# Altium project LPCB280__RLOOP__GCU.PrjPCB
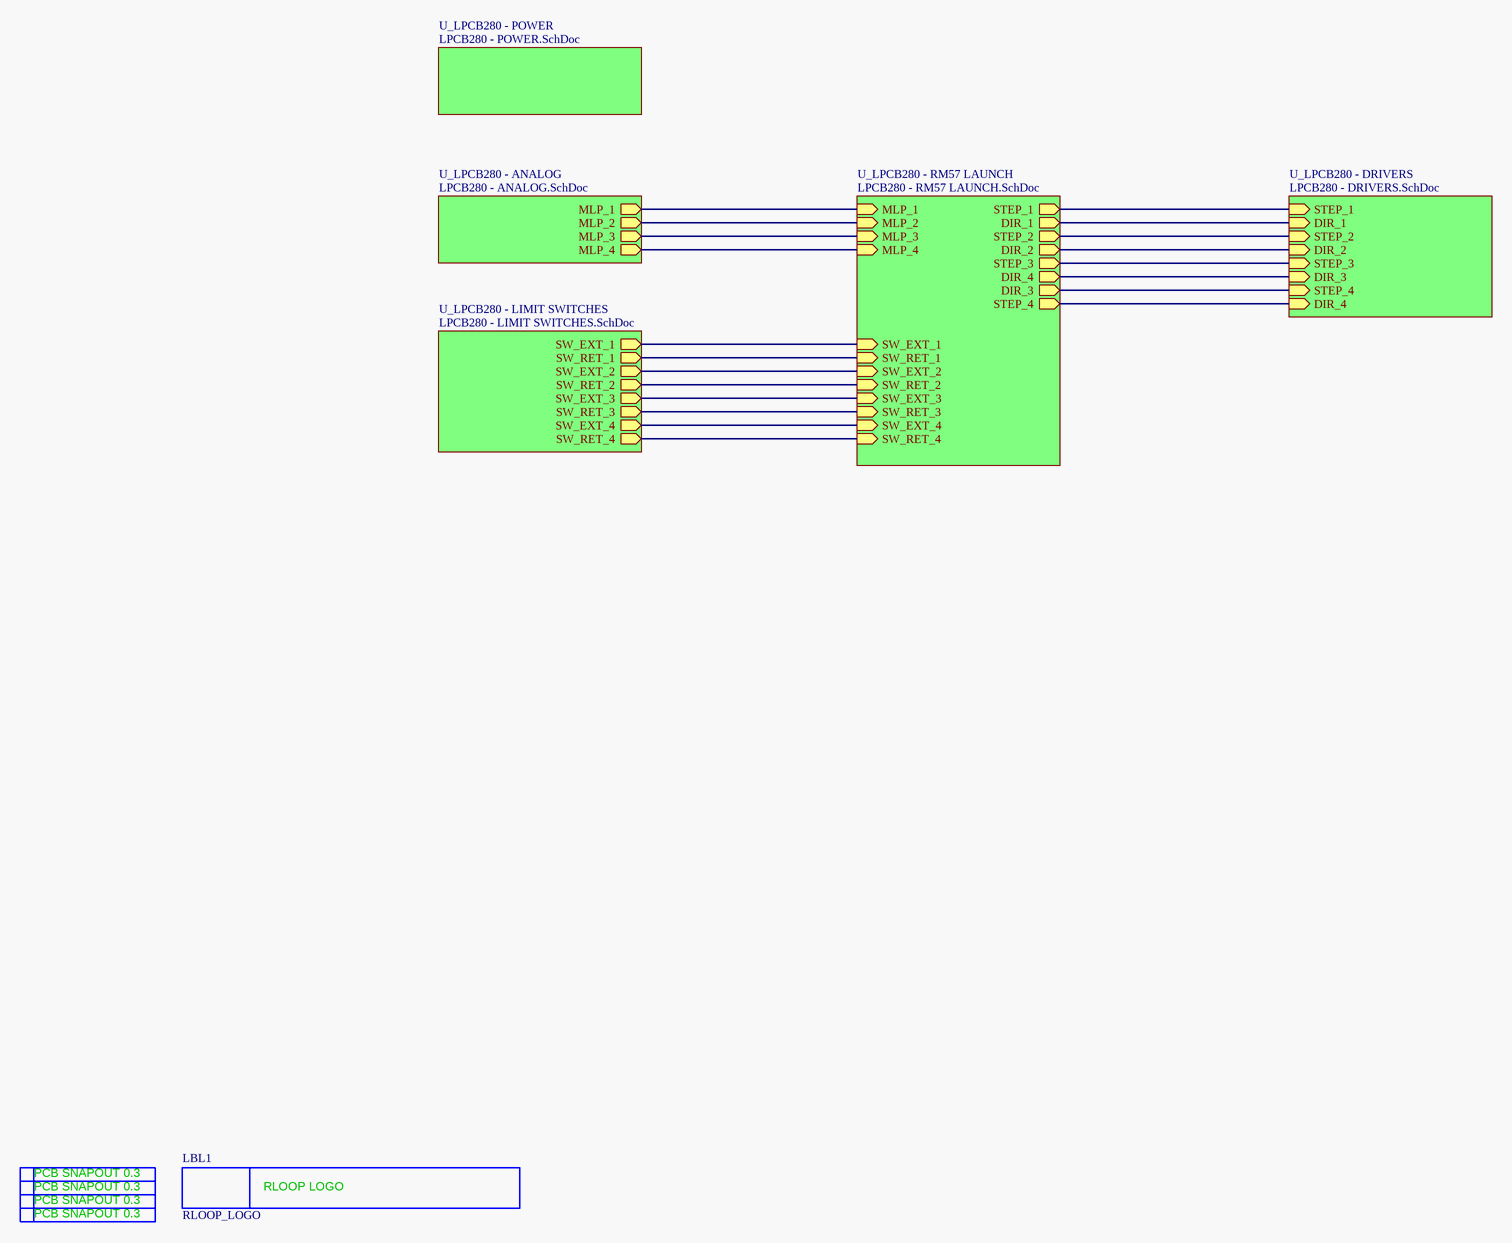
[diagram p0: LPCB280 - TOP.SchDoc]
6 sheets, 81 parts. Net scope: hierarchical (ports join the sheet entries above them; power ports are global).
Board files: LPCB280R0.PcbDoc, LPCB280R0__ASCII.PcbDoc
Sheets:
  LPCB280 - TOP.SchDoc
    U_LPCB280 - POWER = LPCB280 - POWER.SchDoc
    U_LPCB280 - RM57 LAUNCH = LPCB280 - RM57 LAUNCH.SchDoc
    U_LPCB280 - ANALOG = LPCB280 - ANALOG.SchDoc
    U_LPCB280 - LIMIT SWITCHES = LPCB280 - LIMIT SWITCHES.SchDoc
    U_LPCB280 - DRIVERS = LPCB280 - DRIVERS.SchDoc

## Sheet LPCB280 - TOP.SchDoc
size A3; Address1: Factory 10; Address2: 9-13 Dingley Avenue, Dandeong, VICTORIA 3175, AUSTRALIA; DocumentNumber: 1; Revision: 1; SheetNumber: 1; SheetTotal: 6; Lockie__PCB_SUB_ASSEMBLY: PCB Sub Component; Lockie__PCB_ASSEMBLY: PCB Assembly; Lockie__LDL: LPCB280; Lockie__PCB_DESCRIPTION: Gimbal Control Unit (GCU)

### Parts
LBL1  RLOOP_LOGO  [RLOOP_LOGO]  (no BOM)
SN1  PCB_SNAPOUT_0.3MM  [PCB_SNAPOUT_0.3MM]  (value not drawn)  (no BOM)
SN2  PCB_SNAPOUT_0.3MM  [PCB_SNAPOUT_0.3MM]  (value not drawn)  (no BOM)
SN3  PCB_SNAPOUT_0.3MM  [PCB_SNAPOUT_0.3MM]  (value not drawn)  (no BOM)
SN4  PCB_SNAPOUT_0.3MM  [PCB_SNAPOUT_0.3MM]  (value not drawn)  (no BOM)

### Sub-sheets
U_LPCB280 - ANALOG = LPCB280 - ANALOG.SchDoc: MLP_1 (out), MLP_2 (out), MLP_3 (out), MLP_4 (out)
U_LPCB280 - DRIVERS = LPCB280 - DRIVERS.SchDoc: STEP_1 (in), DIR_1 (in), STEP_2 (in), DIR_2 (in), STEP_3 (in), DIR_3 (in), STEP_4 (in), DIR_4 (in)
U_LPCB280 - LIMIT SWITCHES = LPCB280 - LIMIT SWITCHES.SchDoc: SW_EXT_1 (out), SW_RET_1 (out), SW_EXT_2 (out), SW_RET_2 (out), SW_EXT_3 (out), SW_RET_3 (out), SW_EXT_4 (out), SW_RET_4 (out)
U_LPCB280 - POWER = LPCB280 - POWER.SchDoc: no entries
U_LPCB280 - RM57 LAUNCH = LPCB280 - RM57 LAUNCH.SchDoc: MLP_1 (in), MLP_2 (in), MLP_3 (in), MLP_4 (in), SW_EXT_1 (in), SW_RET_1 (in), SW_EXT_4 (in), SW_RET_4 (in), SW_EXT_3 (in), SW_RET_3 (in), SW_EXT_2 (in), SW_RET_2 (in), STEP_1 (out), DIR_1 (out), STEP_2 (out), DIR_2 (out), STEP_3 (out), DIR_4 (out), DIR_3 (out), STEP_4 (out)

### Nets
DIR_1: sheet U_LPCB280 - RM57 LAUNCH/DIR_1, sheet U_LPCB280 - DRIVERS/DIR_1
DIR_2: sheet U_LPCB280 - RM57 LAUNCH/DIR_2, sheet U_LPCB280 - DRIVERS/DIR_2
DIR_3: sheet U_LPCB280 - RM57 LAUNCH/DIR_3, sheet U_LPCB280 - DRIVERS/STEP_4
DIR_4: sheet U_LPCB280 - RM57 LAUNCH/DIR_4, sheet U_LPCB280 - DRIVERS/DIR_3
STEP_1: sheet U_LPCB280 - RM57 LAUNCH/STEP_1, sheet U_LPCB280 - DRIVERS/STEP_1
STEP_2: sheet U_LPCB280 - RM57 LAUNCH/STEP_2, sheet U_LPCB280 - DRIVERS/STEP_2
STEP_3: sheet U_LPCB280 - RM57 LAUNCH/STEP_3, sheet U_LPCB280 - DRIVERS/STEP_3
STEP_4: sheet U_LPCB280 - RM57 LAUNCH/STEP_4, sheet U_LPCB280 - DRIVERS/DIR_4
SW_EXT_1: sheet U_LPCB280 - RM57 LAUNCH/SW_EXT_1, sheet U_LPCB280 - LIMIT SWITCHES/SW_EXT_1
SW_EXT_2: sheet U_LPCB280 - RM57 LAUNCH/SW_EXT_2, sheet U_LPCB280 - LIMIT SWITCHES/SW_EXT_2
SW_EXT_3: sheet U_LPCB280 - RM57 LAUNCH/SW_EXT_3, sheet U_LPCB280 - LIMIT SWITCHES/SW_EXT_3
SW_EXT_4: sheet U_LPCB280 - RM57 LAUNCH/SW_EXT_4, sheet U_LPCB280 - LIMIT SWITCHES/SW_EXT_4
SW_RET_1: sheet U_LPCB280 - RM57 LAUNCH/SW_RET_1, sheet U_LPCB280 - LIMIT SWITCHES/SW_RET_1
SW_RET_2: sheet U_LPCB280 - RM57 LAUNCH/SW_RET_2, sheet U_LPCB280 - LIMIT SWITCHES/SW_RET_2
SW_RET_3: sheet U_LPCB280 - RM57 LAUNCH/SW_RET_3, sheet U_LPCB280 - LIMIT SWITCHES/SW_RET_3
SW_RET_4: sheet U_LPCB280 - RM57 LAUNCH/SW_RET_4, sheet U_LPCB280 - LIMIT SWITCHES/SW_RET_4
NetCN1_2: sheet U_LPCB280 - RM57 LAUNCH/MLP_1, sheet U_LPCB280 - ANALOG/MLP_1
NetCN2_2: sheet U_LPCB280 - RM57 LAUNCH/MLP_3, sheet U_LPCB280 - ANALOG/MLP_3
NetCN4_2: sheet U_LPCB280 - RM57 LAUNCH/MLP_2, sheet U_LPCB280 - ANALOG/MLP_2
NetCN5_2: sheet U_LPCB280 - RM57 LAUNCH/MLP_4, sheet U_LPCB280 - ANALOG/MLP_4

### Notes on the sheet
- PCB COMPONENT DESCRIPTION
- LDL NUMBER
- Assembly Details
- Size
- Drawing File Name
- Revision
- http://sil3.com.au
  ACN: 123 529 064
  Factory 10
  9-13 Dingley Avenue
  Dandenong, VICTORIA
  Australia
- Scale
- A3
- Sheet Details
- N.T.S
- Sheet:
- Of:
- (in symbol PCB_SNAPOUT_0.3MM) PCB SNAPOUT 0.3
- (in symbol RLOOP_LOGO) RLOOP LOGO

### Library data of the parts
LBL1 = RLOOP_LOGO: FMEDA__CHANNEL: DIAG; FMEDA__FUNCTION_IN_SYSTEM: *
SN1-SN4 = PCB_SNAPOUT_0.3MM: PCB Snapout + 0.3mm; FMEDA__CHANNEL: DIAG; FMEDA__FUNCTION_IN_SYSTEM: *

## Sheet LPCB280 - POWER.SchDoc
size A3; Address1: Factory 10; Address2: 9-13 Dingley Avenue, Dandeong, VICTORIA 3175, AUSTRALIA; DocumentNumber: 5; Revision: 1; SheetNumber: 5; SheetTotal: 6; Lockie__PCB_SUB_ASSEMBLY: PCB Sub Component; Lockie__PCB_ASSEMBLY: PCB Assembly; Lockie__LDL: LPCB280; Lockie__PCB_DESCRIPTION: Gimbal Control Unit (GCU)
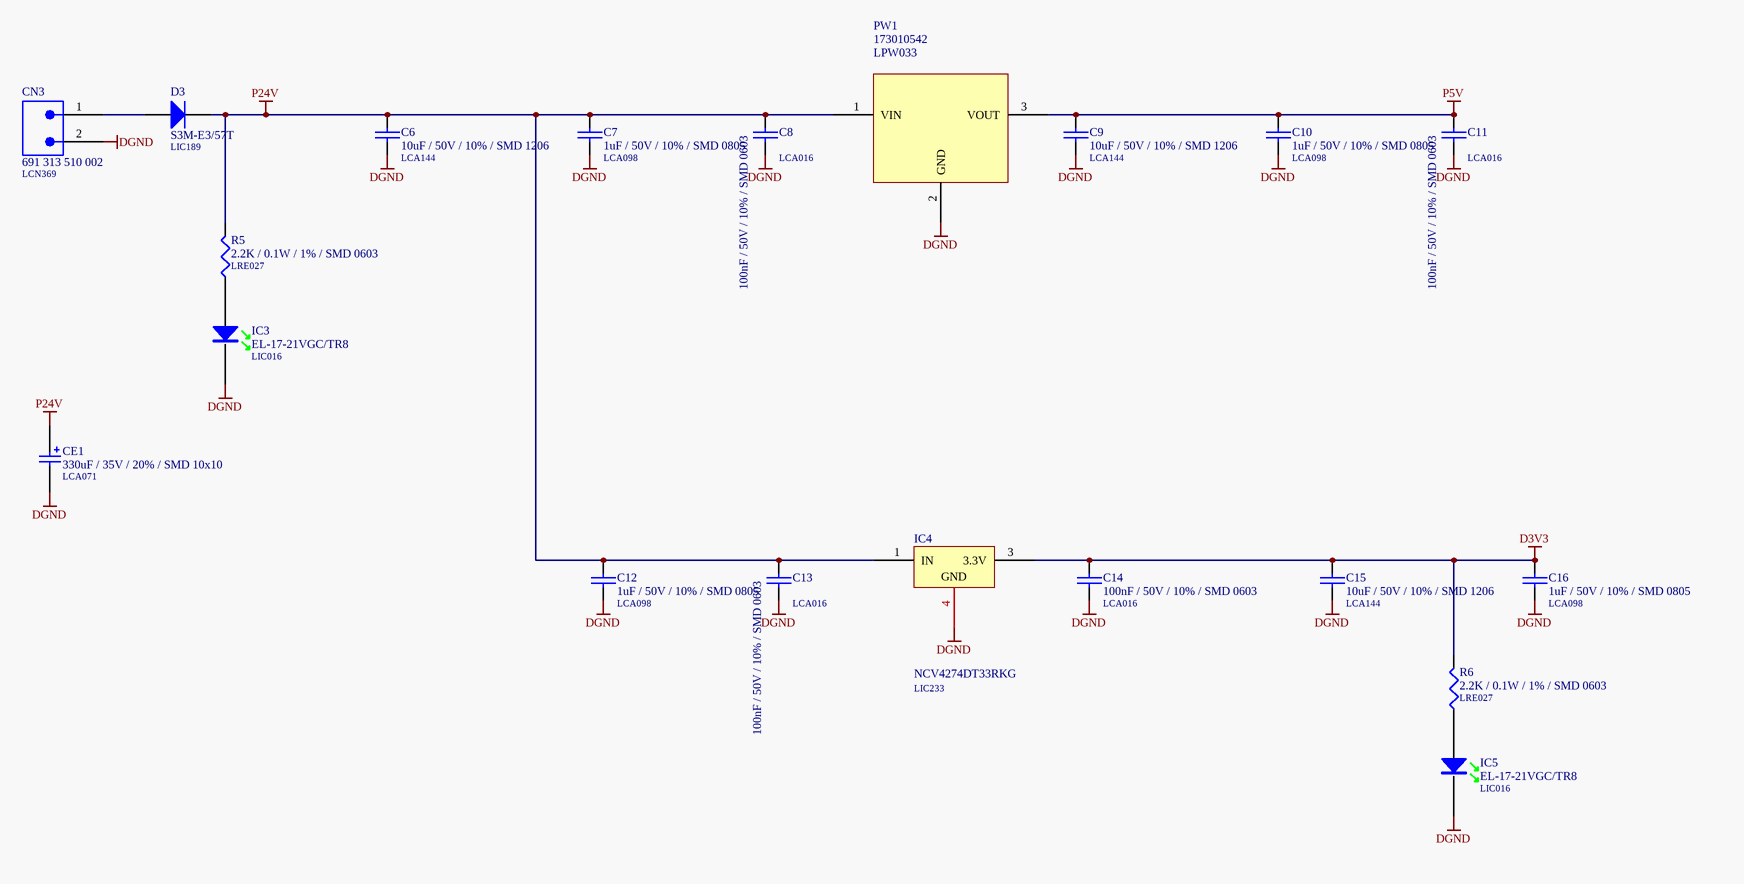
[diagram p1: LPCB280 - POWER.SchDoc]

### Parts
C6  10uF / 50V / 10% / SMD 1206  LDL_NUMBER: LCA144  [LFP043__CC3216-1206]
C7  1uF / 50V / 10% / SMD 0805  LDL_NUMBER: LCA098  [LFP010__CC2012-0805-IPC7351_B]
C8  100nF / 50V / 10% / SMD 0603  LDL_NUMBER: LCA016  [LFP011__CC1608-0603-IPC7351_B]
C9  10uF / 50V / 10% / SMD 1206  LDL_NUMBER: LCA144  [LFP043__CC3216-1206]
C10  1uF / 50V / 10% / SMD 0805  LDL_NUMBER: LCA098  [LFP010__CC2012-0805-IPC7351_B]
C11  100nF / 50V / 10% / SMD 0603  LDL_NUMBER: LCA016  [LFP011__CC1608-0603-IPC7351_B]
C12  1uF / 50V / 10% / SMD 0805  LDL_NUMBER: LCA098  [LFP010__CC2012-0805-IPC7351_B]
C13  100nF / 50V / 10% / SMD 0603  LDL_NUMBER: LCA016  [LFP011__CC1608-0603-IPC7351_B]
C14  100nF / 50V / 10% / SMD 0603  LDL_NUMBER: LCA016  [LFP011__CC1608-0603-IPC7351_B]
C15  10uF / 50V / 10% / SMD 1206  LDL_NUMBER: LCA144  [LFP043__CC3216-1206]
C16  1uF / 50V / 10% / SMD 0805  LDL_NUMBER: LCA098  [LFP010__CC2012-0805-IPC7351_B]
CE1  330uF / 35V / 20% / SMD 10x10  LDL_NUMBER: LCA071  [LFP041__NICHICON_WT_10X10]
CN3  691 313 510 002  LDL_NUMBER: LCN369  [691 313 510 002]
D3  S3M-E3/57T  LDL_NUMBER: LIC189  [LFP040__DO-214AB]
IC3  EL-17-21VGC/TR8  LDL_NUMBER: LIC016  [CR2012-0805-LED]
IC4  NCV4274DT33RKG  LDL_NUMBER: LIC233  [LFP019__369A-13]
IC5  EL-17-21VGC/TR8  LDL_NUMBER: LIC016  [CR2012-0805-LED]
PW1  173010542  LDL_NUMBER: LPW033  [173010542]
R5  2.2K / 0.1W / 1% / SMD 0603  LDL_NUMBER: LRE027  [LFP020__CR1608-0603-IPC7351_B]
R6  2.2K / 0.1W / 1% / SMD 0603  LDL_NUMBER: LRE027  [LFP020__CR1608-0603-IPC7351_B]

### Nets
D3V3: C14.1 C15.1 C16.1 IC4.3(3.3V) R6.2
DGND: C6.2 C7.2 C8.2 C9.2 C10.2 C11.2 C12.2 C13.2 C14.2 C15.2 C16.2 CE1.2 CN3.2 IC3.K IC4.4(GND) IC5.K PW1.2(GND)
P5V: C9.1 C10.1 C11.1 PW1.3(VOUT)
P24V: C6.1 C7.1 C8.1 C12.1 C13.1 CE1.1 D3.1(K) IC4.1(IN) PW1.1(VIN) R5.2
NetCN3_1: CN3.1 D3.2(A)
NetIC3_A: IC3.A R5.1
NetIC5_A: IC5.A R6.1

### Notes on the sheet
- PCB COMPONENT DESCRIPTION
- LDL NUMBER
- Assembly Details
- Size
- Drawing File Name
- Revision
- http://sil3.com.au
  ACN: 123 529 064
  Factory 10
  9-13 Dingley Avenue
  Dandenong, VICTORIA
  Australia
- Scale
- A3
- Sheet Details
- N.T.S
- Sheet:
- Of:

### Library data of the parts
C6 C9 C15 = 10uF / 50V / 10% / SMD 1206: Capacitor, Ceramic Chip, 10uF, 50V, X5R, 10%, SMD 1206 [LCA144]; Value: 10u; FMEDA__OPERATING__TEMP_MAX: 85; FMEDA__OPERATING__TEMP_MIN: -55; FMEDA__OPERATING__TEMP_TYP: 27; FMEDA__OPERATING__VOLTAGE_MAX: 50; FMEDA__OPERATING__VOLTAGE_MIN: 0; FMEDA__CHANNEL: COM; FMEDA__FUNCTION_IN_SYSTEM: *
C7 C10 C12 C16 = 1uF / 50V / 10% / SMD 0805: Capacitor, Ceramic Chip, 1uF, 50V, SMD 0805 [LCA098]; Value: 1u; FMEDA__OPERATING__VOLTAGE_MAX: 3.3; FMEDA__OPERATING__VOLTAGE_MIN: 0; FMEDA__OPERATING__TEMP_MAX: 50; FMEDA__OPERATING__TEMP_MIN: -20; FMEDA__OPERATING__TEMP_TYP: 27; FMEDA__CHANNEL: COM; FMEDA__OPERATING__VOLTAGE_TYP: 3.3; FMEDA__FUNCTION_IN_SYSTEM: *
C8 C11 C13 C14 = 100nF / 50V / 10% / SMD 0603: Capacitor, Ceramic Chip, 100nF (0.1uF), 50V, 5%, SMD 0603 [LCA016]; Value: 100n; FMEDA__OPERATING__VOLTAGE_MIN: 0; FMEDA__OPERATING__VOLTAGE_MAX: 3.3; FMEDA__OPERATING__TEMP_MIN: -20; FMEDA__OPERATING__TEMP_TYP: 27; FMEDA__OPERATING__TEMP_MAX: 50; FMEDA__CHANNEL: COM; FMEDA__FUNCTION_IN_SYSTEM: *; FMEDA__OPERATING__VOLTAGE_TYP: 3.3
CE1 = 330uF / 35V / 20% / SMD 10x10: Capacitor, Aluminum Electrolytic, 330uF, 35V, 20%, SMD (10mm x 10mm) [LCA071]; FMEDA__OPERATING__TEMP_MAX: 50; FMEDA__OPERATING__TEMP_MIN: -20; FMEDA__OPERATING__TEMP_TYP: 27; FMEDA__OPERATING__VOLTAGE_MAX: 0; Value: 330u; FMEDA__CHANNEL: COM; FMEDA__OPERATING__VOLTAGE_MIN: 0; FMEDA__OPERATING__VOLTAGE_TYP: 0; FMEDA__FUNCTION_IN_SYSTEM: *
CN3 = 691 313 510 002: Connector, Pluggable Terminal Block, 5.08mm, 2 Way, PTH; FMEDA__CHANNEL: COM; FMEDA__OPERATING__CURRENT_MAX: 0; FMEDA__OPERATING__TEMP_MAX: 50; FMEDA__OPERATING__TEMP_MIN: -20; FMEDA__OPERATING__TEMP_TYP: 27; FMEDA__OPERATING__VOLTAGE_MAX: 16; FMEDA__OPERATING__VOLTAGE_TYP: 12; FMEDA__FUNCTION_IN_SYSTEM: *; FMEDA__OPERATING__CURRENT_MIN: 0; FMEDA__OPERATING__CURRENT_TYP: 0; FMEDA__OPERATING__VOLTAGE_MIN: 0
D3 = S3M-E3/57T: Diode, General Purpose Rectifier, 3A, 200V, SMD DO-214AB [LIC189]; FMEDA__OPERATING__CURRENT_MAX: 0; FMEDA__OPERATING__TEMP_MAX: 50; FMEDA__OPERATING__TEMP_MIN: -20; FMEDA__OPERATING__TEMP_TYP: 27; FMEDA__CHANNEL: COM; FMEDA__OPERATING__CURRENT_MIN: 0; FMEDA__OPERATING__CURRENT_TYP: 0; FMEDA__OPERATING__VOLTAGE_MAX: 0; FMEDA__OPERATING__VOLTAGE_MIN: 0; FMEDA__OPERATING__VOLTAGE_TYP: 0; FMEDA__FUNCTION_IN_SYSTEM: *
IC3 IC5 = EL-17-21VGC/TR8: LED, SMD, 0805 Green [LIC016]; FMEDA__OPERATING__TEMP_MAX: 50; FMEDA__OPERATING__TEMP_MIN: -20; FMEDA__OPERATING__TEMP_TYP: 27; FMEDA__CHANNEL: COM; FMEDA__FUNCTION_IN_SYSTEM: *
IC4 = NCV4274DT33RKG: IC, Voltage Regulator, 400mA, 3.3V LDO, SMD DPAK [LIC233]; FMEDA__OPERATING__OUTPUT_CURRENT_MIN: 0; FMEDA__OPERATING__TEMP_MAX: 50; FMEDA__OPERATING__TEMP_MIN: -20; FMEDA__OPERATING__TEMP_TYP: 27; VALUE: 0; Note: Obey Thermal Design Rules; FMEDA__CHANNEL: COM; FMEDA__OPERATING__OUTPUT_CURRENT_TYP: 0; FMEDA__OPERATING__VOLTAGE_MAX: 0; FMEDA__OPERATING__VOLTAGE_MIN: 0; FMEDA__OPERATING__VOLTAGE_TYP: 0; FMEDA__FUNCTION_IN_SYSTEM: *
R5 R6 = 2.2K / 0.1W / 1% / SMD 0603: Resistor, Ceramic Chip, 2.2K, 0.1W, 1%, SMD 0603 [LRE027]; FMEDA__OPERATING__VOLTAGE_MIN: 0; FMEDA__OPERATING__TEMP_MIN: -20; FMEDA__OPERATING__TEMP_TYP: 27; FMEDA__OPERATING__TEMP_MAX: 50; FMEDA__CHANNEL: COM; VALUE: 2.2K; FMEDA__OPERATING__VOLTAGE_MAX: 0; FMEDA__OPERATING__POWER_MIN: 0; FMEDA__OPERATING__POWER_MAX: 0; FMEDA__FUNCTION_IN_SYSTEM: *; FMEDA__OPERATING__VOLTAGE_TYP: 0

## Sheet LPCB280 - RM57 LAUNCH.SchDoc
size A3; Address1: Factory 10; Address2: 9-13 Dingley Avenue, Dandeong, VICTORIA 3175, AUSTRALIA; DocumentNumber: 6; Revision: 1; SheetNumber: 6; SheetTotal: 6; Lockie__PCB_SUB_ASSEMBLY: PCB Sub Component; Lockie__PCB_ASSEMBLY: PCB Assembly; Lockie__LDL: LPCB280; Lockie__PCB_DESCRIPTION: Gimbal Control Unit (GCU)
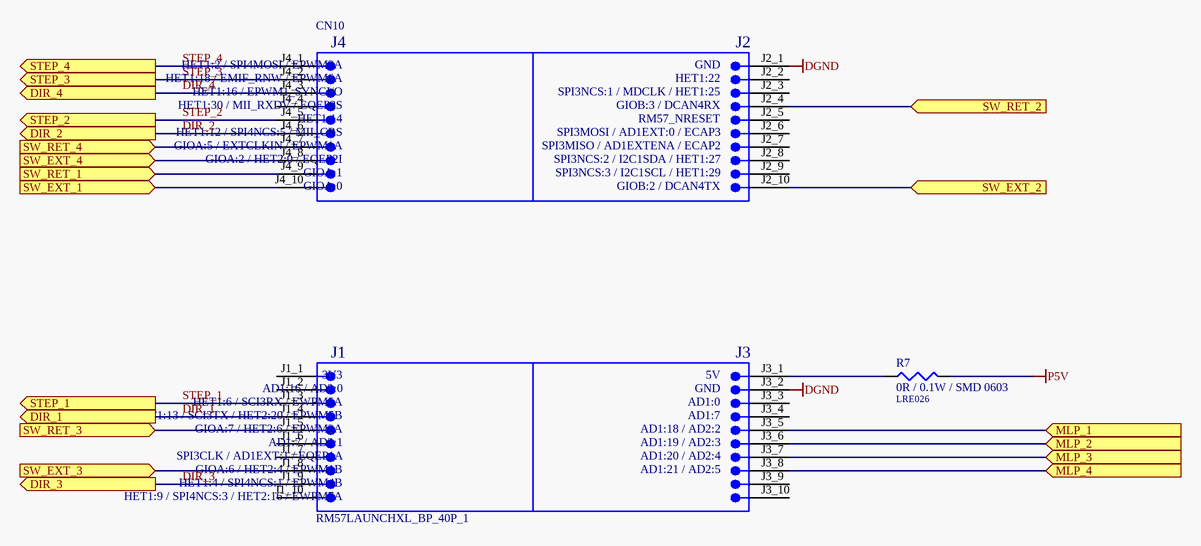
[diagram p2: LPCB280 - RM57 LAUNCH.SchDoc]

### Parts
CN10  RM57LAUNCHXL_BP_40P_1  [RM57LAUNCHXL_BP_40P_1]  (no BOM)
R7  0R / 0.1W / SMD 0603  LDL_NUMBER: LRE026  [LFP020__CR1608-0603-IPC7351_B]

### Ports
DIR_1 (out), DIR_2 (out), DIR_3 (out), DIR_4 (out), MLP_1 (in), MLP_2 (in), MLP_3 (in), MLP_4 (in), STEP_1 (out), STEP_2 (out), STEP_3 (out), STEP_4 (out), SW_EXT_1 (in), SW_EXT_2 (in), SW_EXT_3 (in), SW_EXT_4 (in), SW_RET_1 (in), SW_RET_2 (in), SW_RET_3 (in), SW_RET_4 (in)

### Nets
DGND: CN10.J2_1 CN10.J3_2
P5V: R7.2
DIR_1: CN10.J1_4 ; port DIR_1
DIR_2: CN10.J4_6 ; port DIR_2
DIR_3: CN10.J1_9 ; port DIR_3
DIR_4: CN10.J4_3 ; port DIR_4
STEP_1: CN10.J1_3 ; port STEP_1
STEP_2: CN10.J4_5 ; port STEP_2
STEP_3: CN10.J4_2 ; port STEP_3
STEP_4: CN10.J4_1 ; port STEP_4
SW_EXT_1: CN10.J4_10 ; port SW_EXT_1
SW_EXT_2: CN10.J2_10 ; port SW_EXT_2
SW_EXT_3: CN10.J1_8 ; port SW_EXT_3
SW_EXT_4: CN10.J4_8 ; port SW_EXT_4
SW_RET_1: CN10.J4_9 ; port SW_RET_1
SW_RET_2: CN10.J2_4 ; port SW_RET_2
SW_RET_3: CN10.J1_5 ; port SW_RET_3
SW_RET_4: CN10.J4_7 ; port SW_RET_4
NetCN1_2: CN10.J3_5 ; port MLP_1
NetCN2_2: CN10.J3_7 ; port MLP_3
NetCN4_2: CN10.J3_6 ; port MLP_2
NetCN5_2: CN10.J3_8 ; port MLP_4
NetCN10_J3_1: CN10.J3_1 R7.1

Not connected (* = marked no-connect by the designer): CN10 J1_1 J1_2 J1_6 J1_7 J1_10 J2_2 J2_3 J2_5 J2_6 J2_7 J2_8 J2_9 J3_3 J3_4 J3_9 J3_10 J4_4

### Notes on the sheet
- PCB COMPONENT DESCRIPTION
- LDL NUMBER
- Assembly Details
- Size
- Drawing File Name
- Revision
- http://sil3.com.au
  ACN: 123 529 064
  Factory 10
  9-13 Dingley Avenue
  Dandenong, VICTORIA
  Australia
- Scale
- A3
- Sheet Details
- N.T.S
- Sheet:
- Of:
- (in symbol RM57LAUNCHXL_BP_40P_1) J4; J2; HET1:2 / SPI4MOSI / EPWM3A; GND; HET1:18 / EMIF_RNW / EPWM6A; HET1:22; HET1:16 / EPWM1_SYNCI/O; SPI3NCS:1 / MDCLK / HET1:25; HET1:30 / MII_RXDV / EQEP2S; GIOB:3 / DCAN4RX; HET1:14; RM57_NRESET; HET1:12 / SPI4NCS:5 / MII_CRS; SPI3MOSI / AD1EXT:0 / ECAP3; GIOA:5 / EXTCLKIN / EPWM1A; SPI3MISO / AD1EXTENA / ECAP2; GIOA:2 / HET2:0 / EQEP2I; SPI3NCS:2 / I2C1SDA / HET1:27; GIOA:1; SPI3NCS:3 / I2C1SCL / HET1:29; GIOA:0; GIOB:2 / DCAN4TX; J1; J3; 3V3; 5V; AD1:16 / AD2:0; HET1:6 / SCI3RX / EWPM5A; AD1:0; HET1:13 / SCI3TX / HET2:20 / EPWM5B; AD1:7; GIOA:7 / HET2:6 / EPWM2A; AD1:18 / AD2:2; AD1:7 / AD2:1; AD1:19 / AD2:3; SPI3CLK / AD1EXT:1 / EQEP1A; AD1:20 / AD2:4; GIOA:6 / HET2:4 / EPWM1B; AD1:21 / AD2:5; HET1:4 / SPI4NCS:1 / EPWM4B; HET1:9 / SPI4NCS:3 / HET2:16 / EWPM7A

### Library data of the parts
CN10 = RM57LAUNCHXL_BP_40P_1: Connector, RM57L843 LaunchXL, 40Pin Boosterpack Site1; FMEDA__CHANNEL: COM; FMEDA__OPERATING__CURRENT_MAX: 0; FMEDA__OPERATING__TEMP_MAX: 50; FMEDA__OPERATING__TEMP_MIN: -20; FMEDA__OPERATING__TEMP_TYP: 27; FMEDA__OPERATING__VOLTAGE_MAX: 16; FMEDA__OPERATING__VOLTAGE_TYP: 12; FMEDA__FUNCTION_IN_SYSTEM: *; FMEDA__OPERATING__CURRENT_MIN: 0; FMEDA__OPERATING__CURRENT_TYP: 0; FMEDA__OPERATING__VOLTAGE_MIN: 0
R7 = 0R / 0.1W / SMD 0603: Resistor, Ceramic Chip, 0R, 0.1W, SMD 0603 [LRE026]; Value: 0; FMEDA__OPERATING__TEMP_MAX: 50; FMEDA__OPERATING__TEMP_MIN: -20; FMEDA__OPERATING__TEMP_TYP: 27; FMEDA__CHANNEL: COM; FMEDA__OPERATING__POWER_MAX: 0; FMEDA__OPERATING__POWER_MIN: 0; FMEDA__OPERATING__VOLTAGE_MAX: 0; FMEDA__OPERATING__VOLTAGE_MIN: 0; FMEDA__OPERATING__VOLTAGE_TYP: 0; FMEDA__FUNCTION_IN_SYSTEM: *

## Sheet LPCB280 - ANALOG.SchDoc
size A3; Address1: Factory 10; Address2: 9-13 Dingley Avenue, Dandeong, VICTORIA 3175, AUSTRALIA; DocumentNumber: 2; Revision: 1; SheetNumber: 2; SheetTotal: 6; Lockie__PCB_SUB_ASSEMBLY: PCB Sub Component; Lockie__PCB_ASSEMBLY: PCB Assembly; Lockie__LDL: LPCB280; Lockie__PCB_DESCRIPTION: Gimbal Control Unit (GCU)
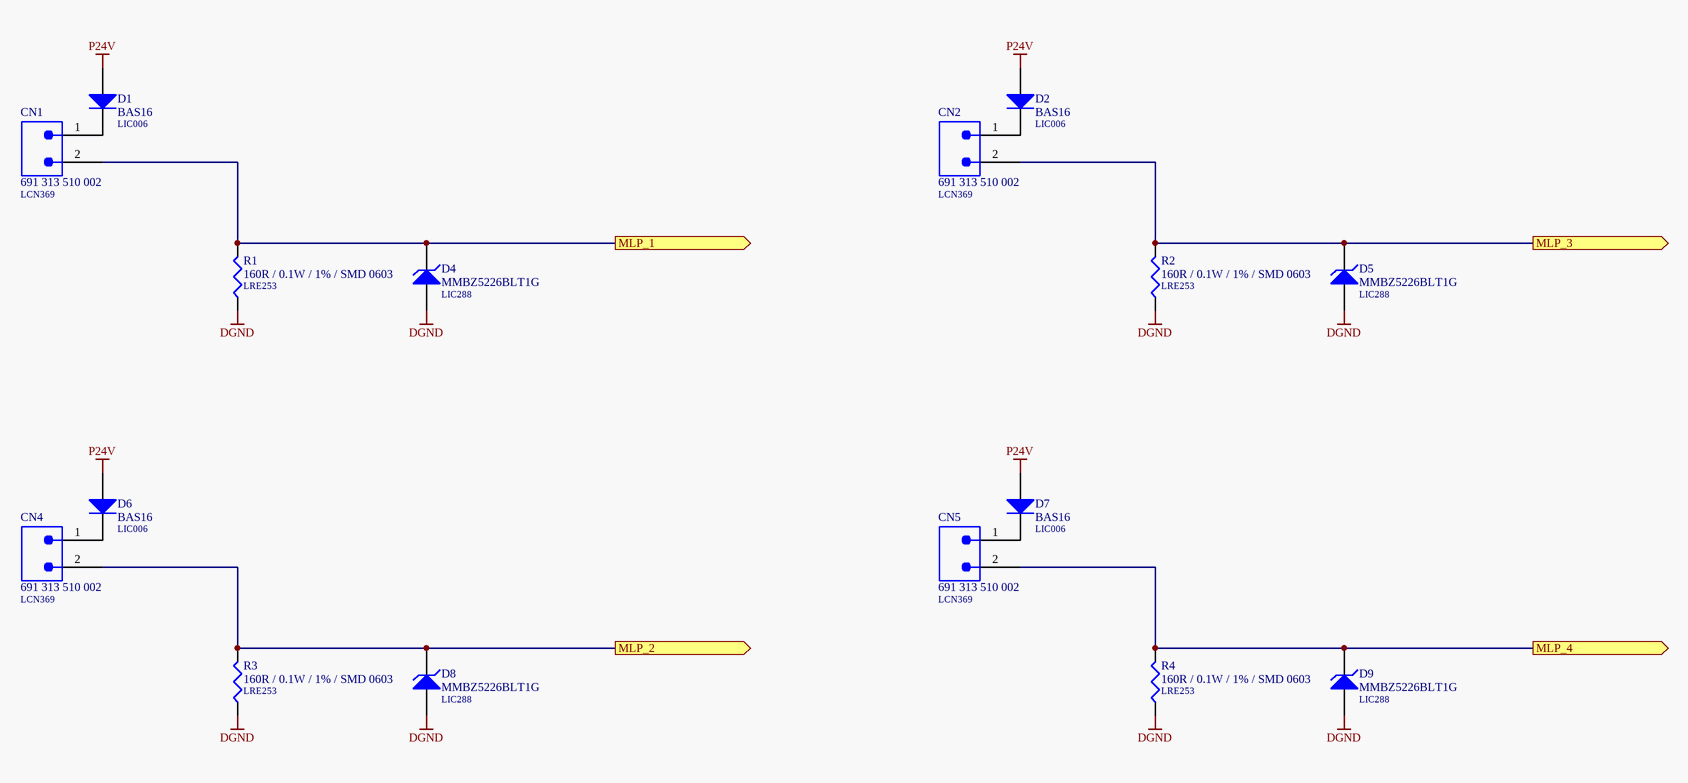
[diagram p3: LPCB280 - ANALOG.SchDoc]

### Parts
CN1  691 313 510 002  LDL_NUMBER: LCN369  [691 313 510 002]
CN2  691 313 510 002  LDL_NUMBER: LCN369  [691 313 510 002]
CN4  691 313 510 002  LDL_NUMBER: LCN369  [691 313 510 002]
CN5  691 313 510 002  LDL_NUMBER: LCN369  [691 313 510 002]
D1  BAS16  LDL_NUMBER: LIC006  [LFP021__SOT23]
D2  BAS16  LDL_NUMBER: LIC006  [LFP021__SOT23]
D4  MMBZ5226BLT1G  LDL_NUMBER: LIC288  [LFP021__SOT23]
D5  MMBZ5226BLT1G  LDL_NUMBER: LIC288  [LFP021__SOT23]
D6  BAS16  LDL_NUMBER: LIC006  [LFP021__SOT23]
D7  BAS16  LDL_NUMBER: LIC006  [LFP021__SOT23]
D8  MMBZ5226BLT1G  LDL_NUMBER: LIC288  [LFP021__SOT23]
D9  MMBZ5226BLT1G  LDL_NUMBER: LIC288  [LFP021__SOT23]
R1  160R / 0.1W / 1% / SMD 0603  LDL_NUMBER: LRE253  [LFP020__CR1608-0603-IPC7351_B]
R2  160R / 0.1W / 1% / SMD 0603  LDL_NUMBER: LRE253  [LFP020__CR1608-0603-IPC7351_B]
R3  160R / 0.1W / 1% / SMD 0603  LDL_NUMBER: LRE253  [LFP020__CR1608-0603-IPC7351_B]
R4  160R / 0.1W / 1% / SMD 0603  LDL_NUMBER: LRE253  [LFP020__CR1608-0603-IPC7351_B]

### Ports
MLP_1 (out), MLP_2 (out), MLP_3 (out), MLP_4 (out)

### Nets
DGND: D4.1(A) D5.1(A) D8.1(A) D9.1(A) R1.1 R2.1 R3.1 R4.1
P24V: D1.1(A) D2.1(A) D6.1(A) D7.1(A)
NetCN1_1: CN1.1 D1.3(K)
NetCN1_2: CN1.2 D4.3(K) R1.2 ; port MLP_1
NetCN2_1: CN2.1 D2.3(K)
NetCN2_2: CN2.2 D5.3(K) R2.2 ; port MLP_3
NetCN4_1: CN4.1 D6.3(K)
NetCN4_2: CN4.2 D8.3(K) R3.2 ; port MLP_2
NetCN5_1: CN5.1 D7.3(K)
NetCN5_2: CN5.2 D9.3(K) R4.2 ; port MLP_4

### Notes on the sheet
- PCB COMPONENT DESCRIPTION
- LDL NUMBER
- Assembly Details
- Size
- Drawing File Name
- Revision
- http://sil3.com.au
  ACN: 123 529 064
  Factory 10
  9-13 Dingley Avenue
  Dandenong, VICTORIA
  Australia
- Scale
- A3
- Sheet Details
- N.T.S
- Sheet:
- Of:

### Library data of the parts
CN1 CN2 CN4 CN5 = 691 313 510 002: as CN3 on sheet LPCB280 - POWER; FMEDA__FUNCTION_IN_SYSTEM: *; FMEDA__OPERATING__CURRENT_MIN: 0; FMEDA__OPERATING__CURRENT_TYP: 0; FMEDA__OPERATING__VOLTAGE_MIN: 0
D1 D2 D6 D7 = BAS16: Diode, Small Signal, 0.2A, 85V, SMD SOT-23 [LIC006]; FMEDA__OPERATING__CURRENT_MIN: 0; FMEDA__OPERATING__TEMP_MIN: -20; FMEDA__OPERATING__TEMP_TYP: 27; FMEDA__OPERATING__TEMP_MAX: 50; FMEDA__CHANNEL: COM; FMEDA__OPERATING__CURRENT_MAX: 0; FMEDA__OPERATING__VOLTAGE_MIN: 0; FMEDA__OPERATING__VOLTAGE_MAX: 0; FMEDA__FUNCTION_IN_SYSTEM: *; FMEDA__OPERATING__CURRENT_TYP: 0; FMEDA__OPERATING__VOLTAGE_TYP: 0
D4 D5 D8 D9 = MMBZ5226BLT1G: Diode, Zener, 3.3V, 0.225W, SMD [LIC288]; FMEDA__OPERATING__CURRENT_MAX: 0.1; FMEDA__OPERATING__CURRENT_MIN: 0; FMEDA__OPERATING__CURRENT_TYP: 0.01; FMEDA__OPERATING__TEMP_MAX: 50; FMEDA__OPERATING__TEMP_MIN: -20; FMEDA__OPERATING__TEMP_TYP: 27; FMEDA__CHANNEL: COM; FMEDA__OPERATING__VOLTAGE_MAX: 0; FMEDA__OPERATING__VOLTAGE_MIN: 0; FMEDA__OPERATING__VOLTAGE_TYP: 0; FMEDA__FUNCTION_IN_SYSTEM: *
R1-R4 = 160R / 0.1W / 1% / SMD 0603: Resistor, Ceramic Chip, 160R, 0.1W, 1%, SMD 0603 [LRE253]; FMEDA__OPERATING__POWER_MAX: 0; FMEDA__OPERATING__TEMP_MAX: 50; FMEDA__OPERATING__TEMP_MIN: -20; FMEDA__OPERATING__TEMP_TYP: 27; FMEDA__CHANNEL: COM; Value: 160R; FMEDA__OPERATING__POWER_MIN: 0; FMEDA__OPERATING__VOLTAGE_MAX: 0; FMEDA__OPERATING__VOLTAGE_MIN: 0; FMEDA__OPERATING__VOLTAGE_TYP: 0; FMEDA__FUNCTION_IN_SYSTEM: *

## Sheet LPCB280 - LIMIT SWITCHES.SchDoc
size A3; Address1: Factory 10; Address2: 9-13 Dingley Avenue, Dandeong, VICTORIA 3175, AUSTRALIA; DocumentNumber: 4; Revision: 1; SheetNumber: 4; SheetTotal: 6; Lockie__PCB_SUB_ASSEMBLY: PCB Sub Component; Lockie__PCB_ASSEMBLY: PCB Assembly; Lockie__LDL: LPCB280; Lockie__PCB_DESCRIPTION: Gimbal Control Unit (GCU)
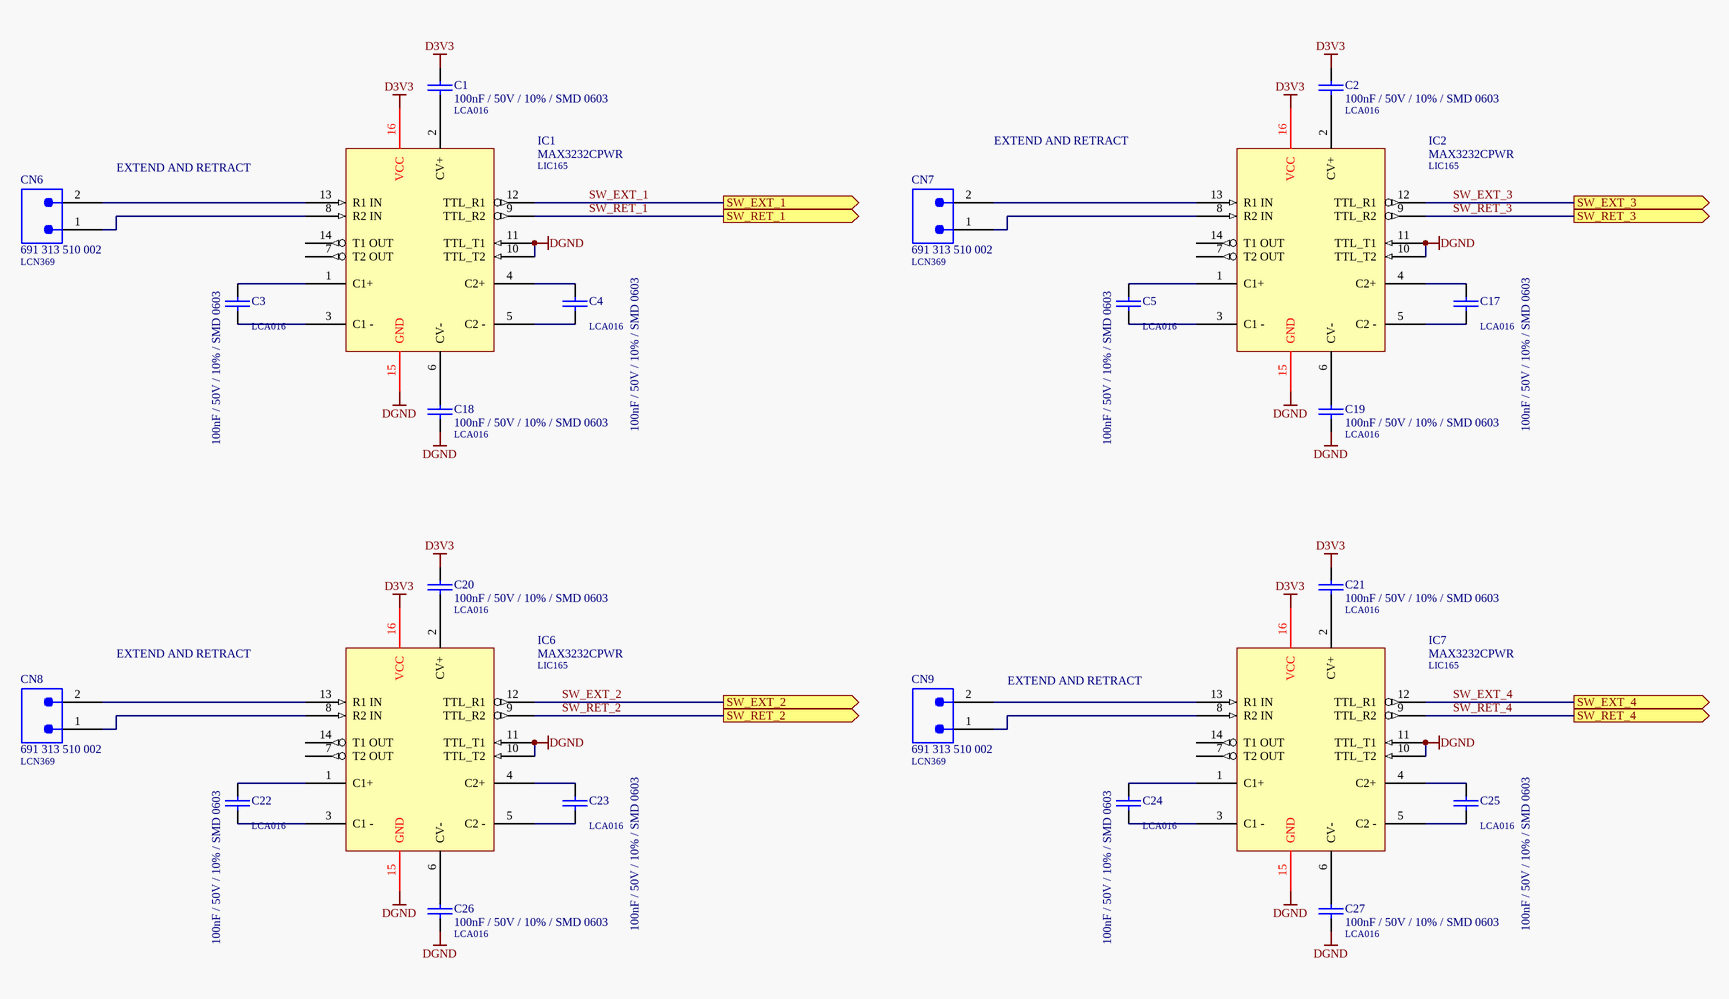
[diagram p4: LPCB280 - LIMIT SWITCHES.SchDoc]

### Parts
C1  100nF / 50V / 10% / SMD 0603  LDL_NUMBER: LCA016  [LFP011__CC1608-0603-IPC7351_B]
C2  100nF / 50V / 10% / SMD 0603  LDL_NUMBER: LCA016  [LFP011__CC1608-0603-IPC7351_B]
C3  100nF / 50V / 10% / SMD 0603  LDL_NUMBER: LCA016  [LFP011__CC1608-0603-IPC7351_B]
C4  100nF / 50V / 10% / SMD 0603  LDL_NUMBER: LCA016  [LFP011__CC1608-0603-IPC7351_B]
C5  100nF / 50V / 10% / SMD 0603  LDL_NUMBER: LCA016  [LFP011__CC1608-0603-IPC7351_B]
C17  100nF / 50V / 10% / SMD 0603  LDL_NUMBER: LCA016  [LFP011__CC1608-0603-IPC7351_B]
C18  100nF / 50V / 10% / SMD 0603  LDL_NUMBER: LCA016  [LFP011__CC1608-0603-IPC7351_B]
C19  100nF / 50V / 10% / SMD 0603  LDL_NUMBER: LCA016  [LFP011__CC1608-0603-IPC7351_B]
C20  100nF / 50V / 10% / SMD 0603  LDL_NUMBER: LCA016  [LFP011__CC1608-0603-IPC7351_B]
C21  100nF / 50V / 10% / SMD 0603  LDL_NUMBER: LCA016  [LFP011__CC1608-0603-IPC7351_B]
C22  100nF / 50V / 10% / SMD 0603  LDL_NUMBER: LCA016  [LFP011__CC1608-0603-IPC7351_B]
C23  100nF / 50V / 10% / SMD 0603  LDL_NUMBER: LCA016  [LFP011__CC1608-0603-IPC7351_B]
C24  100nF / 50V / 10% / SMD 0603  LDL_NUMBER: LCA016  [LFP011__CC1608-0603-IPC7351_B]
C25  100nF / 50V / 10% / SMD 0603  LDL_NUMBER: LCA016  [LFP011__CC1608-0603-IPC7351_B]
C26  100nF / 50V / 10% / SMD 0603  LDL_NUMBER: LCA016  [LFP011__CC1608-0603-IPC7351_B]
C27  100nF / 50V / 10% / SMD 0603  LDL_NUMBER: LCA016  [LFP011__CC1608-0603-IPC7351_B]
CN6  691 313 510 002  LDL_NUMBER: LCN369  [691 313 510 002]
CN7  691 313 510 002  LDL_NUMBER: LCN369  [691 313 510 002]
CN8  691 313 510 002  LDL_NUMBER: LCN369  [691 313 510 002]
CN9  691 313 510 002  LDL_NUMBER: LCN369  [691 313 510 002]
IC1  MAX3232CPWR  LDL_NUMBER: LIC165  [LFP049__TSSOP-16]
IC2  MAX3232CPWR  LDL_NUMBER: LIC165  [LFP049__TSSOP-16]
IC6  MAX3232CPWR  LDL_NUMBER: LIC165  [LFP049__TSSOP-16]
IC7  MAX3232CPWR  LDL_NUMBER: LIC165  [LFP049__TSSOP-16]

### Ports
SW_EXT_1 (out), SW_EXT_2 (out), SW_EXT_3 (out), SW_EXT_4 (out), SW_RET_1 (out), SW_RET_2 (out), SW_RET_3 (out), SW_RET_4 (out)

### Nets
D3V3: C1.1 C2.1 C20.1 C21.1 IC1.16(VCC) IC2.16(VCC) IC6.16(VCC) IC7.16(VCC)
DGND: C18.2 C19.2 C26.2 C27.2 IC1.10(TTL_T2) IC1.11(TTL_T1) IC1.15(GND) IC2.10(TTL_T2) IC2.11(TTL_T1) IC2.15(GND) IC6.10(TTL_T2) IC6.11(TTL_T1) IC6.15(GND) IC7.10(TTL_T2) IC7.11(TTL_T1) IC7.15(GND)
SW_EXT_1: IC1.12(TTL_R1) ; port SW_EXT_1
SW_EXT_2: IC6.12(TTL_R1) ; port SW_EXT_2
SW_EXT_3: IC2.12(TTL_R1) ; port SW_EXT_3
SW_EXT_4: IC7.12(TTL_R1) ; port SW_EXT_4
SW_RET_1: IC1.9(TTL_R2) ; port SW_RET_1
SW_RET_2: IC6.9(TTL_R2) ; port SW_RET_2
SW_RET_3: IC2.9(TTL_R2) ; port SW_RET_3
SW_RET_4: IC7.9(TTL_R2) ; port SW_RET_4
NetC1_2: C1.2 IC1.2(CV+)
NetC2_2: C2.2 IC2.2(CV+)
NetC3_1: C3.1 IC1.1(C1+)
NetC3_2: C3.2 IC1.3(C1_-)
NetC4_1: C4.1 IC1.4(C2+)
NetC4_2: C4.2 IC1.5(C2_-)
NetC5_1: C5.1 IC2.1(C1+)
NetC5_2: C5.2 IC2.3(C1_-)
NetC17_1: C17.1 IC2.4(C2+)
NetC17_2: C17.2 IC2.5(C2_-)
NetC18_1: C18.1 IC1.6(CV-)
NetC19_1: C19.1 IC2.6(CV-)
NetC20_2: C20.2 IC6.2(CV+)
NetC21_2: C21.2 IC7.2(CV+)
NetC22_1: C22.1 IC6.1(C1+)
NetC22_2: C22.2 IC6.3(C1_-)
NetC23_1: C23.1 IC6.4(C2+)
NetC23_2: C23.2 IC6.5(C2_-)
NetC24_1: C24.1 IC7.1(C1+)
NetC24_2: C24.2 IC7.3(C1_-)
NetC25_1: C25.1 IC7.4(C2+)
NetC25_2: C25.2 IC7.5(C2_-)
NetC26_1: C26.1 IC6.6(CV-)
NetC27_1: C27.1 IC7.6(CV-)
NetCN6_1: CN6.1 IC1.8(R2_IN)
NetCN6_2: CN6.2 IC1.13(R1_IN)
NetCN7_1: CN7.1 IC2.8(R2_IN)
NetCN7_2: CN7.2 IC2.13(R1_IN)
NetCN8_1: CN8.1 IC6.8(R2_IN)
NetCN8_2: CN8.2 IC6.13(R1_IN)
NetCN9_1: CN9.1 IC7.8(R2_IN)
NetCN9_2: CN9.2 IC7.13(R1_IN)

Not connected (* = marked no-connect by the designer): IC1 7(T2_OUT) 14(T1_OUT); IC2 7(T2_OUT) 14(T1_OUT); IC6 7(T2_OUT) 14(T1_OUT); IC7 7(T2_OUT) 14(T1_OUT)

### Notes on the sheet
- EXTEND AND RETRACT
- PCB COMPONENT DESCRIPTION
- LDL NUMBER
- Assembly Details
- Size
- Drawing File Name
- Revision
- http://sil3.com.au
  ACN: 123 529 064
  Factory 10
  9-13 Dingley Avenue
  Dandenong, VICTORIA
  Australia
- Scale
- A3
- Sheet Details
- N.T.S
- Sheet:
- Of:

### Library data of the parts
C1-C5 C17-C27 = 100nF / 50V / 10% / SMD 0603: as C8 on sheet LPCB280 - POWER; FMEDA__FUNCTION_IN_SYSTEM: *; FMEDA__OPERATING__VOLTAGE_TYP: 3.3
CN6-CN9 = 691 313 510 002: as CN3 on sheet LPCB280 - POWER; FMEDA__FUNCTION_IN_SYSTEM: *; FMEDA__OPERATING__CURRENT_MIN: 0; FMEDA__OPERATING__CURRENT_TYP: 0; FMEDA__OPERATING__VOLTAGE_MIN: 0
IC1 IC2 IC6 IC7 = MAX3232CPWR: IC, RS232 Line Driver, 3.3V, SMD TSSOP16 [LIC165]; FMEDA__OPERATING__TEMP_MAX: 50; FMEDA__OPERATING__TEMP_MIN: -20; FMEDA__OPERATING__TEMP_TYP: 27; FMEDA__CHANNEL: COM; FMEDA__OPERATING__VOLTAGE_MAX: 3.3; FMEDA__OPERATING__VOLTAGE_MIN: 0; FMEDA__FUNCTION_IN_SYSTEM: *; FMEDA__OPERATING__VOLTAGE_TYP: 3.3

## Sheet LPCB280 - DRIVERS.SchDoc
size A3; Address1: Factory 10; Address2: 9-13 Dingley Avenue, Dandeong, VICTORIA 3175, AUSTRALIA; DocumentNumber: 3; Revision: 1; SheetNumber: 3; SheetTotal: 6; Lockie__PCB_SUB_ASSEMBLY: PCB Sub Component; Lockie__PCB_ASSEMBLY: PCB Assembly; Lockie__LDL: LPCB280; Lockie__PCB_DESCRIPTION: Gimbal Control Unit (GCU)
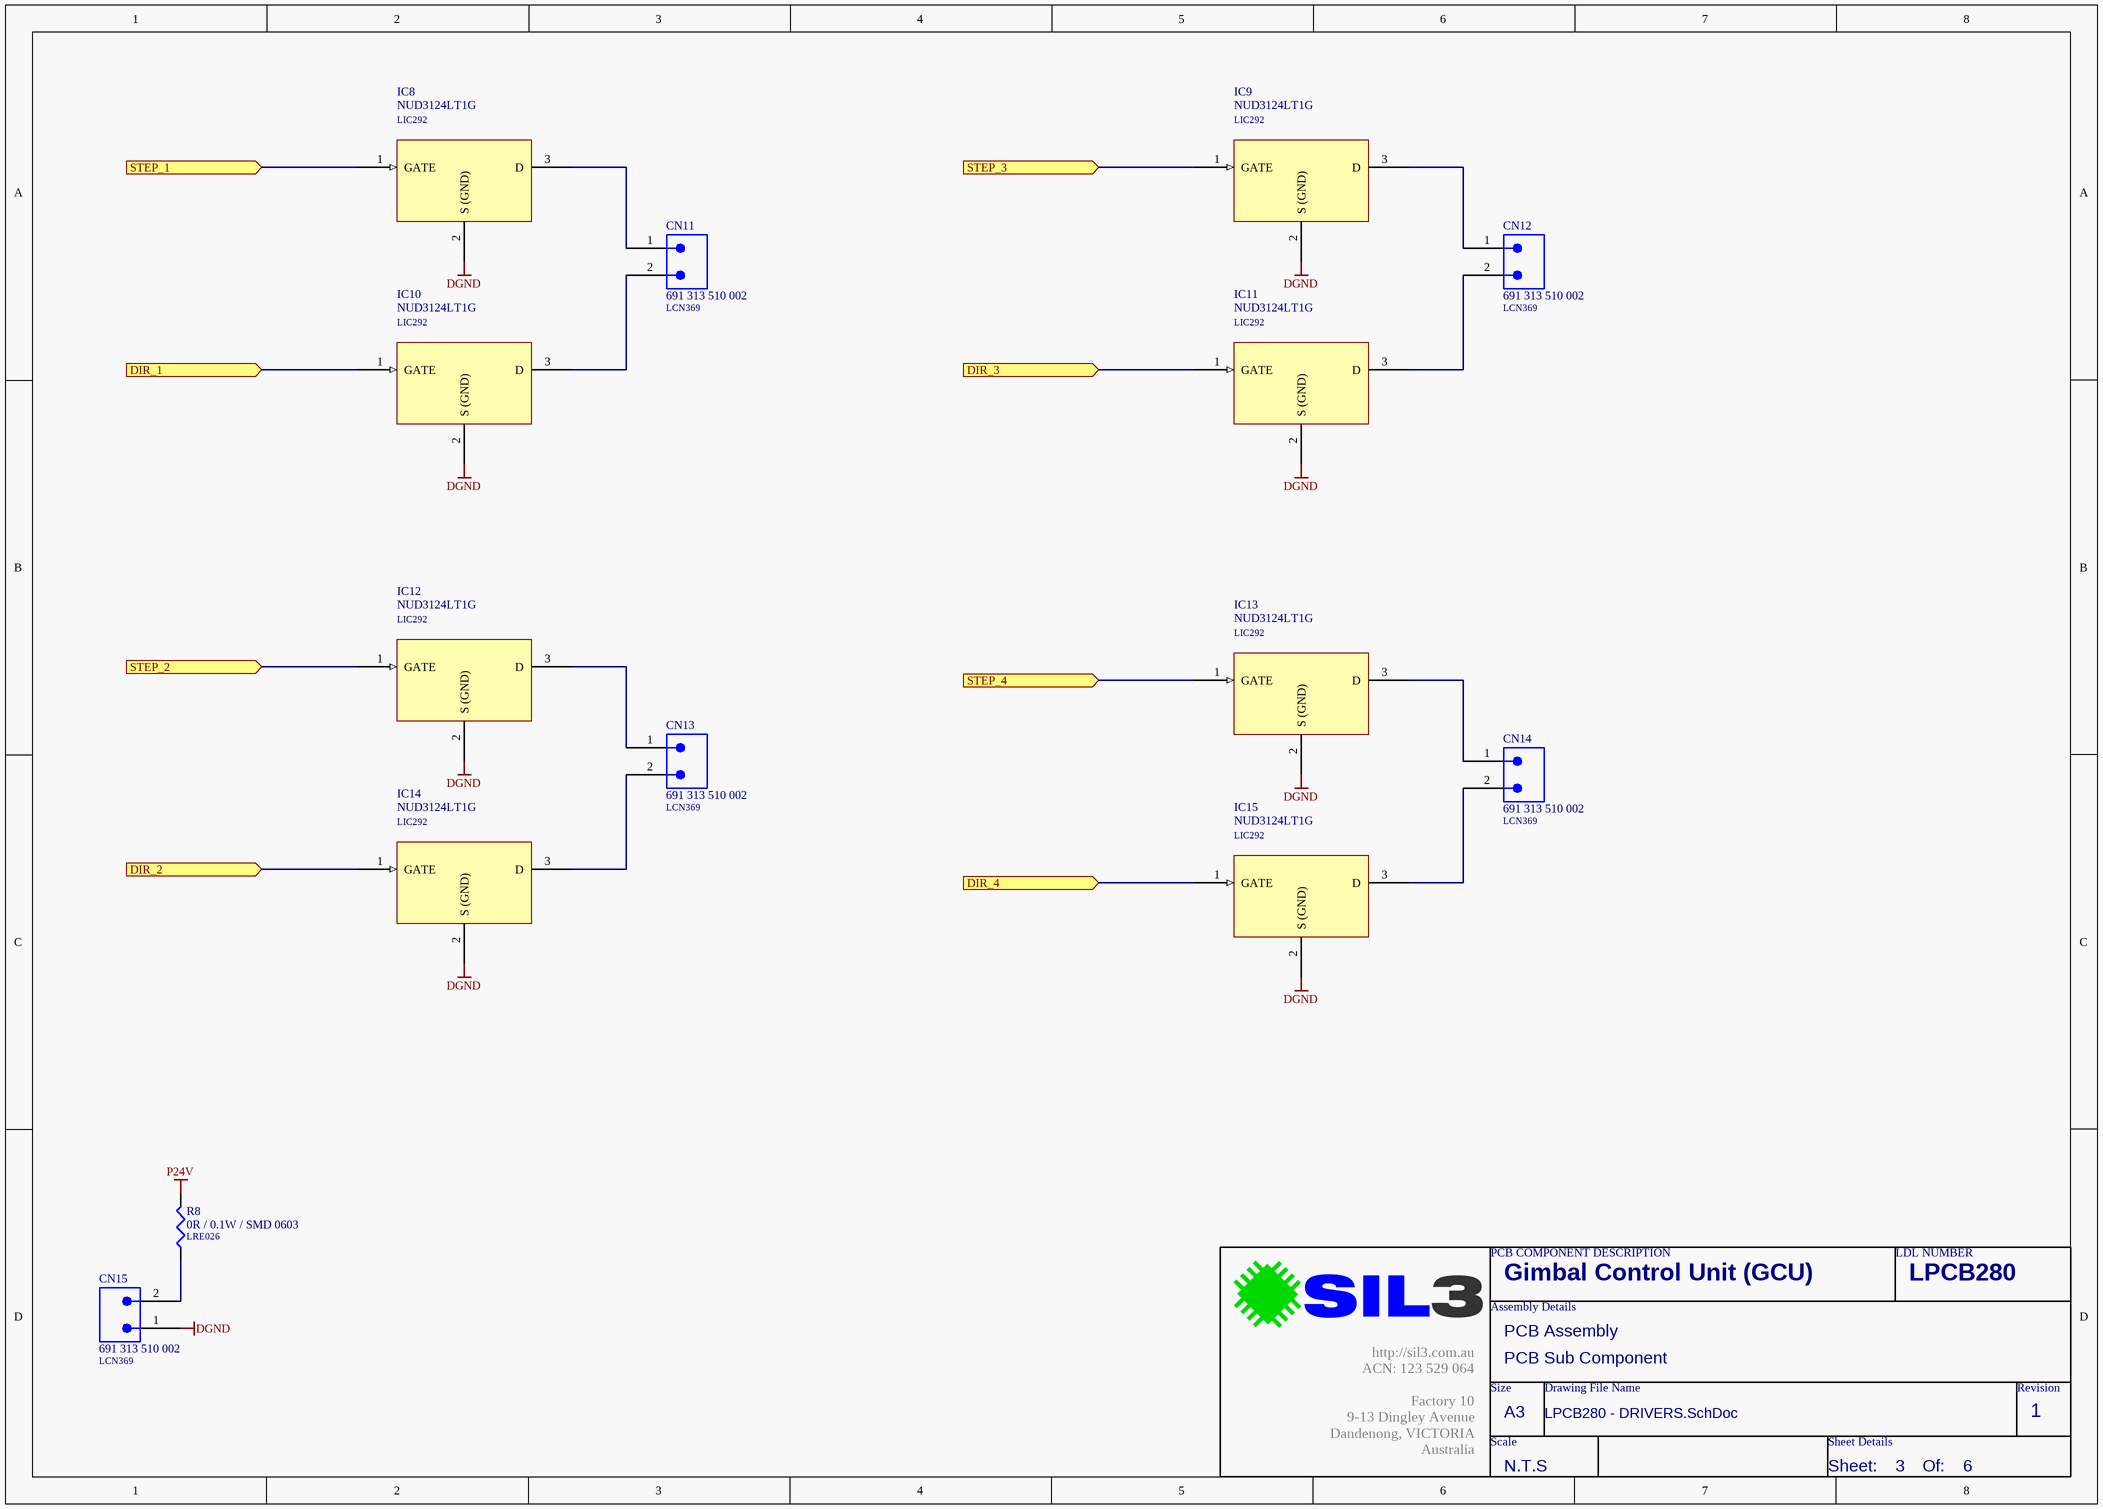
[diagram p5: LPCB280 - DRIVERS.SchDoc]

### Parts
CN11  691 313 510 002  LDL_NUMBER: LCN369  [691 313 510 002]
CN12  691 313 510 002  LDL_NUMBER: LCN369  [691 313 510 002]
CN13  691 313 510 002  LDL_NUMBER: LCN369  [691 313 510 002]
CN14  691 313 510 002  LDL_NUMBER: LCN369  [691 313 510 002]
CN15  691 313 510 002  LDL_NUMBER: LCN369  [691 313 510 002]
IC8  NUD3124LT1G  LDL_NUMBER: LIC292  [LFP021__SOT23]
IC9  NUD3124LT1G  LDL_NUMBER: LIC292  [LFP021__SOT23]
IC10  NUD3124LT1G  LDL_NUMBER: LIC292  [LFP021__SOT23]
IC11  NUD3124LT1G  LDL_NUMBER: LIC292  [LFP021__SOT23]
IC12  NUD3124LT1G  LDL_NUMBER: LIC292  [LFP021__SOT23]
IC13  NUD3124LT1G  LDL_NUMBER: LIC292  [LFP021__SOT23]
IC14  NUD3124LT1G  LDL_NUMBER: LIC292  [LFP021__SOT23]
IC15  NUD3124LT1G  LDL_NUMBER: LIC292  [LFP021__SOT23]
R8  0R / 0.1W / SMD 0603  LDL_NUMBER: LRE026  [LFP020__CR1608-0603-IPC7351_B]

### Ports
DIR_1 (in), DIR_2 (in), DIR_3 (in), DIR_4 (in), STEP_1 (in), STEP_2 (in), STEP_3 (in), STEP_4 (in)

### Nets
DGND: CN15.1 IC8.2(S_(GND)) IC9.2(S_(GND)) IC10.2(S_(GND)) IC11.2(S_(GND)) IC12.2(S_(GND)) IC13.2(S_(GND)) IC14.2(S_(GND)) IC15.2(S_(GND))
P24V: R8.2
DIR_1: IC10.1(GATE) ; port DIR_1
DIR_2: IC14.1(GATE) ; port DIR_2
DIR_3: IC13.1(GATE) ; port STEP_4
DIR_4: IC11.1(GATE) ; port DIR_3
STEP_1: IC8.1(GATE) ; port STEP_1
STEP_2: IC12.1(GATE) ; port STEP_2
STEP_3: IC9.1(GATE) ; port STEP_3
STEP_4: IC15.1(GATE) ; port DIR_4
NetCN11_1: CN11.1 IC8.3(D)
NetCN11_2: CN11.2 IC10.3(D)
NetCN12_1: CN12.1 IC9.3(D)
NetCN12_2: CN12.2 IC11.3(D)
NetCN13_1: CN13.1 IC12.3(D)
NetCN13_2: CN13.2 IC14.3(D)
NetCN14_1: CN14.1 IC13.3(D)
NetCN14_2: CN14.2 IC15.3(D)
NetCN15_2: CN15.2 R8.1

### Notes on the sheet
- PCB COMPONENT DESCRIPTION
- LDL NUMBER
- Assembly Details
- Size
- Drawing File Name
- Revision
- http://sil3.com.au
  ACN: 123 529 064
  Factory 10
  9-13 Dingley Avenue
  Dandenong, VICTORIA
  Australia
- Scale
- A3
- Sheet Details
- N.T.S
- Sheet:
- Of:

### Library data of the parts
CN11-CN15 = 691 313 510 002: as CN3 on sheet LPCB280 - POWER; FMEDA__FUNCTION_IN_SYSTEM: *; FMEDA__OPERATING__CURRENT_MIN: 0; FMEDA__OPERATING__CURRENT_TYP: 0; FMEDA__OPERATING__VOLTAGE_MIN: 0
IC8-IC15 = NUD3124LT1G: IC, Relay Driver, 28V Industrial, SMD SOT23 [LIC292]; FMEDA__OPERATING__TEMP_MIN: -20; FMEDA__OPERATING__TEMP_TYP: 27; FMEDA__OPERATING__TEMP_MAX: 50; FMEDA__OPERATING__VOLTAGE_MIN: 0; FMEDA__OPERATING__VOLTAGE_TYP: 13; FMEDA__OPERATING__VOLTAGE_MAX: 18; FMEDA__OPERATING__POWER_TYP: 0.1; FMEDA__OPERATING__POWER_MAX: 0.15; FMEDA__CHANNEL: COM; FMEDA__FUNCTION_IN_SYSTEM: *; FMEDA__OPERATING__POWER_MIN: 0
R8 = 0R / 0.1W / SMD 0603: as R7 on sheet LPCB280 - RM57 LAUNCH; FMEDA__OPERATING__POWER_MAX: 0; FMEDA__OPERATING__POWER_MIN: 0; FMEDA__OPERATING__VOLTAGE_MAX: 0; FMEDA__OPERATING__VOLTAGE_MIN: 0; FMEDA__OPERATING__VOLTAGE_TYP: 0; FMEDA__FUNCTION_IN_SYSTEM: *

## Nets that join several sheets
D3V3: LPCB280 - POWER (5 pins), LPCB280 - LIMIT SWITCHES (8 pins)
DGND: LPCB280 - POWER (17 pins), LPCB280 - RM57 LAUNCH (CN10.J2_1 CN10.J3_2), LPCB280 - ANALOG (8 pins), LPCB280 - LIMIT SWITCHES (16 pins), LPCB280 - DRIVERS (9 pins)
P5V: LPCB280 - POWER (C9.1 C10.1 C11.1 PW1.3), LPCB280 - RM57 LAUNCH (R7.2)
P24V: LPCB280 - POWER (10 pins), LPCB280 - ANALOG (D1.1 D2.1 D6.1 D7.1), LPCB280 - DRIVERS (R8.2)
DIR_1: LPCB280 - RM57 LAUNCH (CN10.J1_4), LPCB280 - DRIVERS (IC10.1)
DIR_2: LPCB280 - RM57 LAUNCH (CN10.J4_6), LPCB280 - DRIVERS (IC14.1)
DIR_3: LPCB280 - RM57 LAUNCH (CN10.J1_9), LPCB280 - DRIVERS (IC13.1)
DIR_4: LPCB280 - RM57 LAUNCH (CN10.J4_3), LPCB280 - DRIVERS (IC11.1)
NetCN1_2: LPCB280 - RM57 LAUNCH (CN10.J3_5), LPCB280 - ANALOG (CN1.2 D4.3 R1.2)
NetCN2_2: LPCB280 - RM57 LAUNCH (CN10.J3_7), LPCB280 - ANALOG (CN2.2 D5.3 R2.2)
NetCN4_2: LPCB280 - RM57 LAUNCH (CN10.J3_6), LPCB280 - ANALOG (CN4.2 D8.3 R3.2)
NetCN5_2: LPCB280 - RM57 LAUNCH (CN10.J3_8), LPCB280 - ANALOG (CN5.2 D9.3 R4.2)
STEP_1: LPCB280 - RM57 LAUNCH (CN10.J1_3), LPCB280 - DRIVERS (IC8.1)
STEP_2: LPCB280 - RM57 LAUNCH (CN10.J4_5), LPCB280 - DRIVERS (IC12.1)
STEP_3: LPCB280 - RM57 LAUNCH (CN10.J4_2), LPCB280 - DRIVERS (IC9.1)
STEP_4: LPCB280 - RM57 LAUNCH (CN10.J4_1), LPCB280 - DRIVERS (IC15.1)
SW_EXT_1: LPCB280 - RM57 LAUNCH (CN10.J4_10), LPCB280 - LIMIT SWITCHES (IC1.12)
SW_EXT_2: LPCB280 - RM57 LAUNCH (CN10.J2_10), LPCB280 - LIMIT SWITCHES (IC6.12)
SW_EXT_3: LPCB280 - RM57 LAUNCH (CN10.J1_8), LPCB280 - LIMIT SWITCHES (IC2.12)
SW_EXT_4: LPCB280 - RM57 LAUNCH (CN10.J4_8), LPCB280 - LIMIT SWITCHES (IC7.12)
SW_RET_1: LPCB280 - RM57 LAUNCH (CN10.J4_9), LPCB280 - LIMIT SWITCHES (IC1.9)
SW_RET_2: LPCB280 - RM57 LAUNCH (CN10.J2_4), LPCB280 - LIMIT SWITCHES (IC6.9)
SW_RET_3: LPCB280 - RM57 LAUNCH (CN10.J1_5), LPCB280 - LIMIT SWITCHES (IC2.9)
SW_RET_4: LPCB280 - RM57 LAUNCH (CN10.J4_7), LPCB280 - LIMIT SWITCHES (IC7.9)